# EAGLE design UV_Sensor_Breakout_VEML6070_v1 (EAGLE 7.5.0)
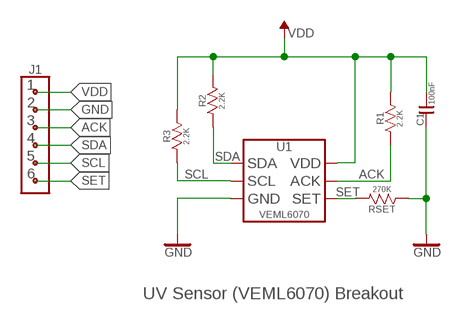
[diagram p0: schematic, sheet 1]

## Parts
C1  100nF  CAPACITOR_0603[1608]  [0603[1608]]
J1  PIN_HEADER_1X06_0.1"_STR_G[2]_PTH  [PIN_HEADER_1X06_0.1"_STR_G[2]_PTH]
R1  2.2K  RESISTOR_0603[1008]  [0603[1608]]
R2  2.2K  RESISTOR_0603[1008]  [0603[1608]]
R3  2.2K  RESISTOR_0603[1008]  [0603[1608]]
RSET  270K  RESISTOR_0603[1008]  [0603[1608]]
U1  VEML6070  UV_LIGHT_SENSOR_I2C_OPLGA  [OPLGA]

## Nets
ACK: J1.3 R1.1 U1.2(ACK)
GND: C1.1 J1.2 RSET.1 U1.1(GND)
SCL: J1.5 R3.1 U1.5(SCL)
SDA: J1.4 R2.1 U1.3(SDA)
SET: J1.6 RSET.2 U1.4(SET)
VDD: C1.2 J1.1 R1.2 R2.2 R3.2 U1.6(VDD)

## Notes on the sheet
- UV Sensor (VEML6070) Breakout

## Library data of the parts
C1 = LuisLab-Pasives:CAPACITOR
J1 = LuisLab-Connectors:PIN_HEADER_1X06
R1-R3 RSET = LuisLab-Pasives:RESISTOR: Sschematic elements and footprints resistors
U1 = LuisLab-Sensors:UV_LIGHT_SENSOR_I2C

## Board
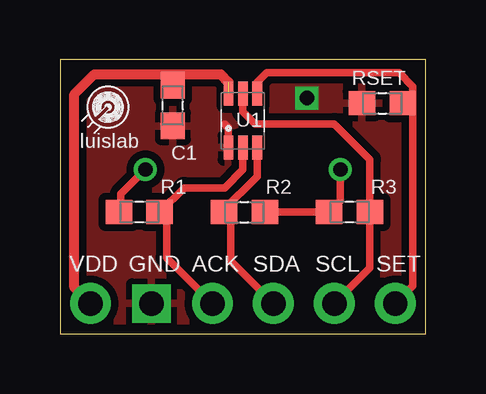
[diagram p1: board, top side]
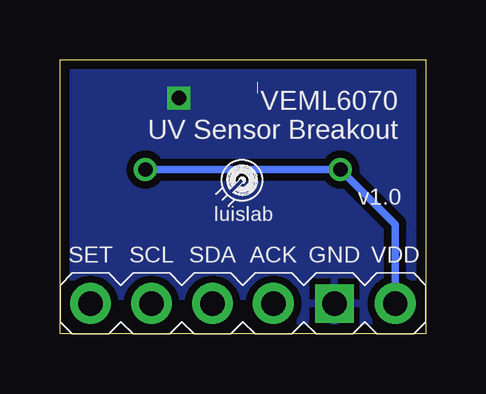
[diagram p2: board, bottom side, seen from below]

Size 15.24 x 11.43 mm. Coordinates in mm from the lower left corner, seen from the top.
Outline: 0,11.43 0,0 15.24,0 15.24,11.43 0,11.43
Copper layers (1*16): Top 0.0356mm / dielectric 1.5011mm / Bottom 0.0356mm
Design rules "LaenPCBOrder": minimum track width 6mil, minimum drill 13mil, track to track 6mil, track to pad 6mil, pad to pad 6mil, via to via 6mil, smd to smd 6mil, copper to edge 15mil, drill to drill 6mil, minimum pad ring 7mil, minimum via ring 7mil, stop-mask expansion 3mil, vias tented up to drill 0mil, thermal gap 10mil

### Footprints (pad centres in the part's own frame; a part is rotated, then mirrored left to right if it is on the bottom)
0603[1608] = smd 1.1 x 1: 1 -0.85,0; 2 0.85,0
PIN_HEADER_1X06_0.1"_STR_G[2]_PTH = drill 1.016 pad 1.7: 1 -6.35,0; 3 -1.27,0; 4 1.27,0; 5 3.81,0; 6 6.35,0 | drill 1.016 pad 1.6 square: 2 -3.81,0
OPLGA = smd 1 x 0.4: 1 -1.125,0.6; 2 -1.125,0; 3 -1.125,-0.6; 4 1.125,-0.6; 5 1.125,0; 6 1.125,0.6

### Placement (x,y rotation side)
C1  4.7,9.52 90 top
J1  7.62,1.27 180 bottom
R1  3.3,5.08 180 top
R2  7.68,5.08 0 top
R3  12.07,5.08 180 top
RSET  13.43,9.62 0 top
U1  7.62,8.89 90 top

### Tracks (layer width: path | path; a pad name or v marks a point on that pad's centre or on a via)
ACK
  Top 0.305: U1.2 7.62,6.86 6.86,6.1 5.17,6.1 R1.1 4.45,4.79 4.45,3.17 J1.3
GND  (via drill 0.6)
  Top 0.305: U1.1 7.02,8.6 6.86,8.76
  other vias: 10.29,9.84
  pour Bottom (isolate 0.305, rank 6): -1.27,-2.54 16.51,-2.54 16.51,13.97 -1.27,13.97
  pour Top (isolate 0.305, rank 6): -2.54,-1.27 17.78,-1.27 17.78,12.7 -2.54,12.7
SCL
  Top 0.305: U1.5 7.62,9.27 8.13,8.76 11.43,8.76 12.92,7.28 R3.1 12.92,2.75 J1.5
SDA
  Top 0.305: U1.3 8.22,6.57 6.77,5.12 R2.1 7.11,4.74 7.11,3.05 J1.4
SET
  Top 0.305: J1.6 14.7,2 14.7,9.65 | 14.7,9.65 14.7,10.32 14.13,10.89 8.6,10.89 8.22,10.51 U1.4 | RSET.2 14.67,9.62 14.7,9.65
VDD  (via drill 0.6)  (1 unrouted)
  Top 0.305: v11.68,6.86 11.68,5.55 R3.2 R2.2 | v3.56,6.86 2.54,5.84 2.54,5.17 R1.2 | C1.2 4.7,10.83
  Top 0.406: 7.02,10.51 6.7,10.83 4.7,10.83 1.43,10.83 0.6,10 0.6,1.94 J1.1
  Bottom 0.305: J1.1 1.27,4.57 v3.56,6.86 v11.68,6.86

### Text on the board
tPlace: luislab | VDD | GND | ACK | SDA | SCL | SET
bPlace: VEML6070 / UV Sensor Breakout | v1.0 | luislab | VDD | GND | ACK | SDA | SCL | SET